# EAGLE schematic pt2399_echo (EAGLE 7.1.0)
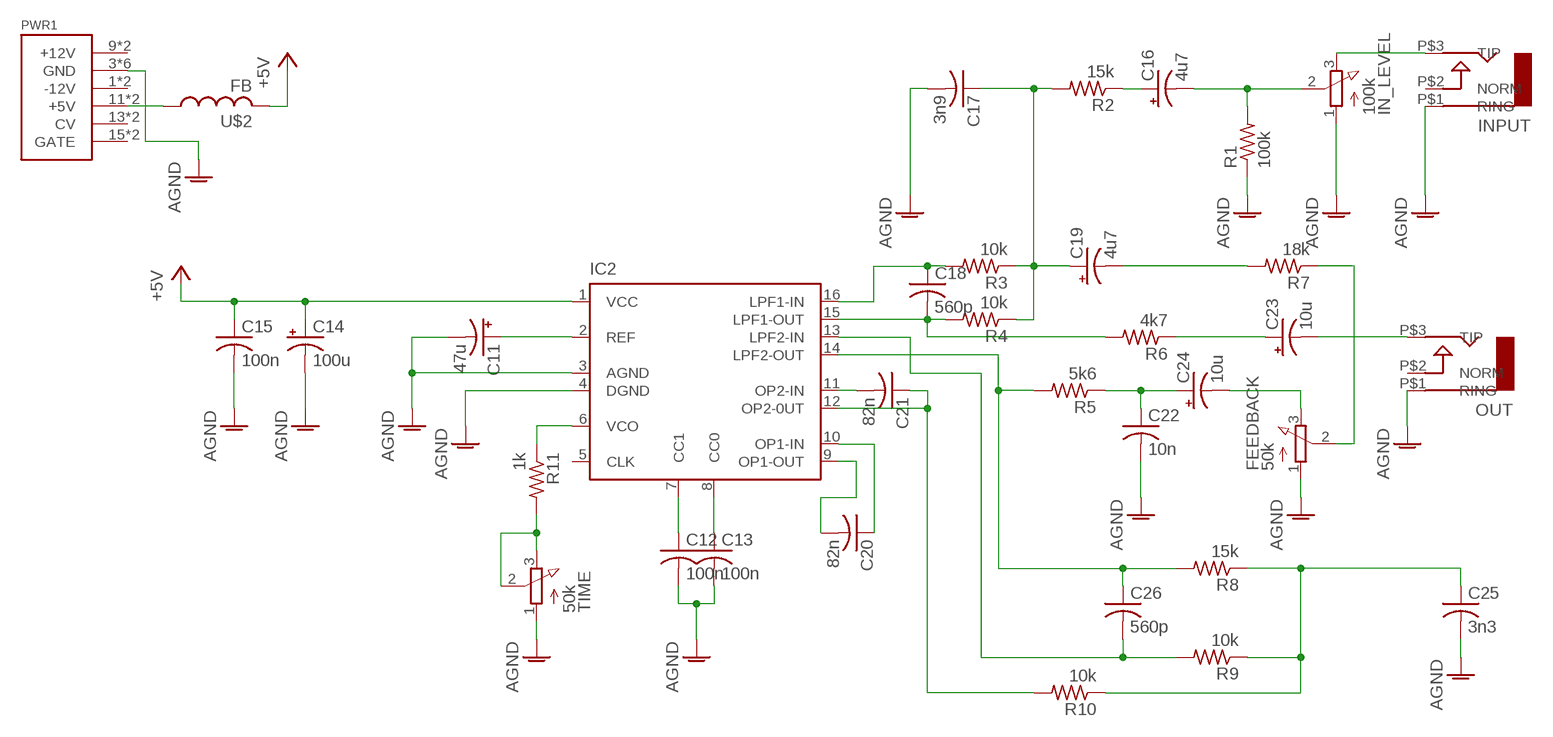
[diagram p0: schematic, sheet 1]

## Parts
C11  47u  CPOL-USB45181A  [B45181A]
C12  100n  C-US050-024X044  [C050-024X044]
C13  100n  C-US050-024X044  [C050-024X044]
C14  100u  CPOL-USB45181A  [B45181A]
C15  100n  C-US025-024X044  [C025-024X044]
C16  4u7  CPOL-USB45181A  [B45181A]
C17  3n9  C-US050-024X044  [C050-024X044]
C18  560p  C-US050-024X044  [C050-024X044]
C19  4u7  CPOL-USB45181A  [B45181A]
C20  82n  C-US050-025X075  [C050-025X075]
C21  82n  C-US050-025X075  [C050-025X075]
C22  10n  C-US050-024X044  [C050-024X044]
C23  10u  CPOL-USB45181A  [B45181A]
C24  10u  CPOL-USB45181A  [B45181A]
C25  3n3  C-US050-024X044  [C050-024X044]
C26  560p  C-US050-024X044  [C050-024X044]
FEEDBACK  50k  3RP/1610N  [3RP/1610N]
IC2  PT2399  [DIP16]
IN_LEVEL  100k  3RP/1610N  [3RP/1610N]
INPUT  AUDIO-JACK  [ERTHENVAR-JACK-90DEG]
OUT  AUDIO-JACK  [ERTHENVAR-JACK-90DEG]
PWR1  POWER  [POWER_16]
R1  100k  R-US_0207/7  [0207/7]
R2  15k  R-US_0207/7  [0207/7]
R3  10k  R-US_0207/7  [0207/7]
R4  10k  R-US_0207/7  [0207/7]
R5  5k6  R-US_0207/7  [0207/7]
R6  4k7  R-US_0207/7  [0207/7]
R7  18k  R-US_0207/7  [0207/7]
R8  15k  R-US_0207/7  [0207/7]
R9  10k  R-US_0207/7  [0207/7]
R10  10k  R-US_0207/7  [0207/7]
R11  1k  R-US_0207/10  [0207/10]
TIME  50k  3RP/1610N  [3RP/1610N]
U$2  FB  [FB]

## Nets
+5V: C14.+ C15.1 IC2.1(VCC) U$2.P$2
AGND: C11.- C12.2 C13.2 C14.- C15.2 C17.2 C22.2 C25.2 FEEDBACK.1(A) IC2.3(AGND) IC2.4(DGND) IN_LEVEL.1(A) INPUT.P$1(RING) OUT.P$1(RING) PWR1.3(GND) PWR1.4(GND) PWR1.5(GND) PWR1.6(GND) PWR1.7(GND) PWR1.8(GND) R1.1 TIME.1(A)
N$1: PWR1.11(+5V) PWR1.12(+5V) U$2.P$1
N$3: C23.+ R6.1
N$4: C12.1 IC2.7(CC1)
N$5: C13.1 IC2.8(CC0)
N$7: IN_LEVEL.3(E) INPUT.P$3(TIP)
N$8: C11.+ IC2.2(REF)
N$9: C16.+ R2.1
N$10: C16.- IN_LEVEL.2(S) R1.2
N$11: C18.2 IC2.15(LPF1-OUT) R4.2 R6.2
N$12: C18.1 IC2.16(LPF1-IN) R3.2
N$13: C17.1 C19.+ R2.2 R3.1 R4.1
N$14: C20.2 IC2.9(OP1-OUT)
N$15: C20.1 IC2.10(OP1-IN)
N$16: C21.2 IC2.11(OP2-IN)
N$17: C23.- OUT.P$3(TIP)
N$18: C26.1 IC2.14(LPF2-OUT) R5.2 R8.2
N$19: C19.- R7.2
N$20: FEEDBACK.2(S) R7.1
N$21: C22.1 C24.+ R5.1
N$22: C24.- FEEDBACK.3(E)
N$23: C21.1 IC2.12(OP2-0UT) R10.2
N$24: C26.2 IC2.13(LPF2-IN) R9.2
N$25: C25.1 R8.1 R9.1 R10.1
N$28: R11.2 TIME.2(S) TIME.3(E)
N$29: IC2.6(VCO) R11.1
Unconnected: IC2.5(CLK) INPUT.P$2(NORM) OUT.P$2(NORM) PWR1.1(-12V) PWR1.2(-12V) PWR1.9(+12V) PWR1.10(+12V) PWR1.13(CV) PWR1.14(CV) PWR1.15(GATE) PWR1.16(GATE)

## Library data of the parts
C11 C14 C16 C19 C23 C24 = rcl:CPOL-US: POLARIZED CAPACITOR, American symbol
C12 C13 C15 C17 C18 C20-C22 C25 C26 = rcl:C-US: CAPACITOR, American symbol
FEEDBACK IN_LEVEL TIME = pot:3RP/1610N: 16mm Potentiometer one level Source: http://www.alphapotentiometers.net/html/16mm_pot_2.html
IC2 = echounit:PT2399: Echo Processor IC
INPUT OUT = erthenvar:AUDIO-JACK: Switching Mono 3.5mm Audio Jack from Erthenvar.
PWR1 = eurorack:POWER
R1-R11 = rcl:R-US_: RESISTOR, American symbol
U$2 = adafruit:FB: Ferrite bead Digikey #P9821BK-ND